# Altium schematic sheet ArbPwrBoost_P4.SchDoc: =ProjectTitle
size B; Engineer: Hab Collector; Organization: Altium Limited; Address1: 3621 Gin Way; Address2: Snellville, GA 30039; SheetNumber: 4; SheetTotal: 8
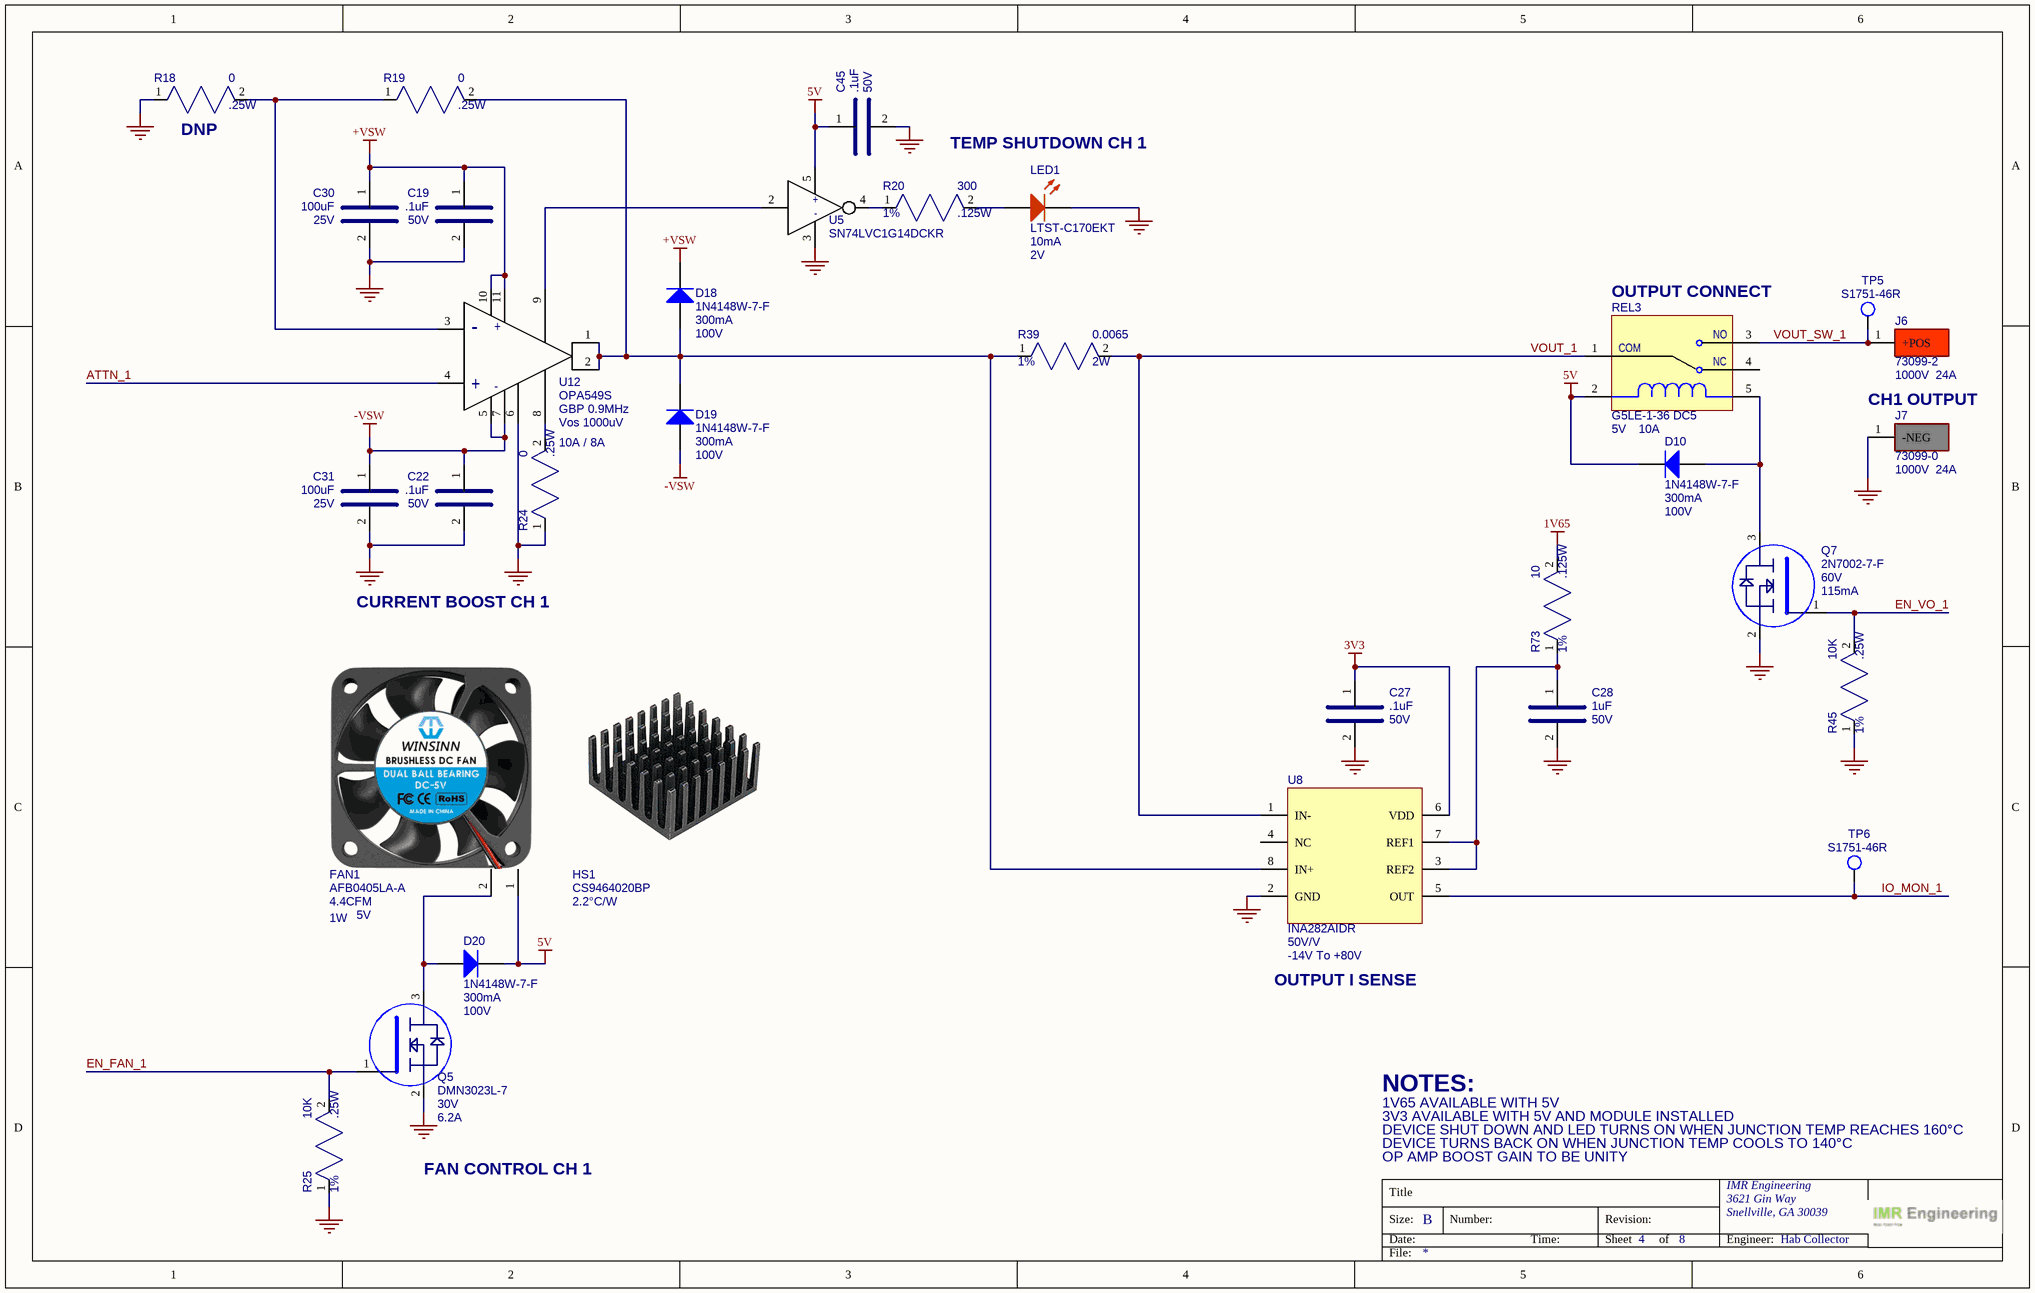
[diagram p0: ArbPwrBoost_P4.SchDoc]

## Parts
C19  value .1uF  Voltage: 50V  [CAP_0805]  (hidden comment: KGM21NR71H104KT)
C22  value .1uF  Voltage: 50V  [CAP_0805]  (hidden comment: KGM21NR71H104KT)
C27  value .1uF  Voltage: 50V  [CAP_0805]  (hidden comment: KGM21NR71H104KT)
C28  value 1uF  Voltage: 50V  [CAP_0805]  (hidden comment: 08055C105K4T2A)
C30  value 100uF  Voltage: 25V  [CAPC6153X670N]  (hidden comment: KCM55WC71E107MH13L)
C31  value 100uF  Voltage: 25V  [CAPC6153X670N]  (hidden comment: KCM55WC71E107MH13L)
C45  value .1uF  Voltage: 50V  [CAP_0805]  (hidden comment: KGM21NR71H104KT)
D10  value 100V  Current: 300mA  [SOD123]  (hidden comment: 1N4148W-7-F)
D18  value 100V  Current: 300mA  [SOD123]  (hidden comment: 1N4148W-7-F)
D19  value 100V  Current: 300mA  [SOD123]  (hidden comment: 1N4148W-7-F)
D20  value 100V  Current: 300mA  [SOD123]  (hidden comment: 1N4148W-7-F)
FAN1  Air Flow: 4.4CFM  Voltage: 5V  Power: 1W  [FAN_AFB0405LA-A]  (hidden comment: AFB0405LA-A)
HS1  Thermal Resistance: 2.2°C/W  [HEATSINK_CS9464020BP]  (hidden comment: CS9464020BP)
J6  value 1000V  Current: 24A  [Pomona_73099-2]  (hidden comment: 73099-2)
J7  value 1000V  Current: 24A  [Pomona_73099-0]  (hidden comment: 73099-0)
LED1  value 2V  Current: 10mA  [LED_0805]  (hidden comment: LTST-C170EKT)
Q5  value 30V  Current: 6.2A  [SOT-23]  (hidden comment: DMN3023L-7)
Q7  value 60V  Current: 115mA  [SOT-23]  (hidden comment: 2N7002-7-F)
R18  value 0  Power: .25W  [RES_0805]  (hidden comment: RC0805JR-070RL)
R19  value 0  Power: .25W  [RES_0805]  (hidden comment: RC0805JR-070RL)
R20  value 300  Power: .125W  Tolerance: 1%  [RES_0805]  (hidden comment: RC0805FR-07300RL)
R24  value 0  Power: .25W  [RES_0805]  (hidden comment: RC0805JR-070RL)
R25  value 10K  Power: .25W  Tolerance: 1%  [RES_0805]  (hidden comment: RC0805FR-7W10KL)
R39  value 0.0065  Tolerance: 1%  Power: 2W  [RES_2512]  (hidden comment: WSL25126L500FEA18)
R45  value 10K  Power: .25W  Tolerance: 1%  [RES_0805]  (hidden comment: RC0805FR-7W10KL)
R73  value 10  Power: .125W  Tolerance: 1%  [RES_0805]  (hidden comment: RC0805FR-1310RL)
REL3  value 5V  Current: 10A  [G5LE]  (hidden comment: G5LE-1-36 DC5)
TP5  S1751-46R  [HARWIN_S1751]
TP6  S1751-46R  [HARWIN_S1751]
U5  SN74LVC1G14DCKR  [SOT-353]
U8  value 50V/V  Common Mode: -14V To +80V  [SOIC-8_54]  (hidden comment: INA282AIDR)
U12  value GBP 0.9MHz  Vos: Vos 1000uV  Peak / Contineous Current: 10A / 8A  [POWER_PACKAGE_11]  (hidden comment: OPA549S)

## Nets
1V65: R73.2
3V3: C27.1 U8.6(VDD)
5V: C45.1 D10.2(K) D20.2(K) FAN1.1 REL3.2 U5.5
+VSW: C19.1 C30.1 D18.2(K) U12.10 U12.11
-VSW: C22.1 C31.1 D19.1(A) U12.5 U12.7
GND: C19.2 C22.2 C27.2 C28.2 C30.2 C31.2 C45.2 J7.1(-NEG) LED1.K Q5.2(E) Q7.2(E) R18.1 R24.1 R25.1 R45.1 U5.3 U8.2(GND) U12.6
ATTN_1: U12.4(+)
EN_FAN_1: Q5.1(B) R25.2
EN_VO_1: Q7.1(B) R45.2
IO_MON_1: TP6.1 U8.5(OUT)
VOUT_1: R39.2 REL3.1(COM) U8.1(IN-)
VOUT_SW_1: J6.1(+POS) REL3.3(NO) TP5.1
NetC28_1: C28.1 R73.1 U8.3(REF2) U8.7(REF1)
NetD10_1: D10.1(A) Q7.3(C) REL3.5
NetD18_1: D18.1(A) D19.2(K) R19.2 R39.1 U8.8(IN+) U12.1 U12.2
NetD20_1: D20.1(A) FAN1.2 Q5.3(C)
NetLED1_A: LED1.A R20.2
NetR18_2: R18.2 R19.1 U12.3(-)
NetR20_1: R20.1 U5.4(Y)
NetR24_2: R24.2 U12.8
NetU5_2: U5.2(A) U12.9

Not connected (* = marked no-connect by the designer): REL3 4(NC); U8 4(NC)

## Notes on the sheet
- (near R18) DNP
- TEMP SHUTDOWN CH 1
- (near REL3) OUTPUT CONNECT
- (near J7) CH1 OUTPUT
- CURRENT BOOST CH 1
- OUTPUT I SENSE
- NOTES:
- 1V65 AVAILABLE WITH 5V
- FAN CONTROL CH 1
- 3V3 AVAILABLE WITH 5V AND MODULE INSTALLED
- DEVICE SHUT DOWN AND LED TURNS ON WHEN JUNCTION TEMP REACHES 160°C
- DEVICE TURNS BACK ON WHEN JUNCTION TEMP COOLS TO 140°C
- OP AMP BOOST GAIN TO BE UNITY
- Title
- Size:
- Date:
- B
- Number:
- Time:
- Revision:
- Sheet
- of
- IMR Engineering
- Engineer:
- File:
- (in symbol IC_SN74LVC1G14DCKR) +; -

## Library data of the parts
C19 C22 C27 C45 = CAP_SMD_0.1UF_50V_0805: CAP CER 0.1UF 50V X7R 0805; MFG: KYOCERA AVX; Case/Package: 0805; MFG_PN: KGM21NR71H104KT; Supplier 1: DigiKey; Supplier Part Number 1: 478-KGM21NR71H104KTCT-ND; Unit Price: .1
C28 = CAP_SMD_1UF_50V_0805: CAP CER 1UF 50V X7R 0805; MFG: KYOCERA AVX; Case/Package: 0805; MFG_PN: 08055C105K4T2A; Supplier 1: DigiKey; Supplier Part Number 1: 478-KAM21KR71H105KUCT-ND; Unit Price: .27
C30 C31 = CAP_SMD_100UF_25V_SMD: CAP CER 100UF 25V X7S SMD; MFG: Murata Electronics; Case/Package: CAPC6153X670N; MFG_PN: KCM55WC71E107MH13L; Supplier 1: DigiKey; Supplier Part Number 1: 490-KCM55WC71E107MH13LCT-ND; Unit Price: 5.68
D10 D18-D20 = DIODE_1N4148W-7-F: RELAY REED SPDT 250MA 5V; MFG: Diodes Inc; Case/Package: SOD-123; Supplier 1: DigiKey; Supplier Part Number 1: 1N4148W-FDICT-ND; Unit Price: .16; MFG_PN: 1N4148W-7-F
FAN1 = FAN_AFB0405LA-A: FAN AXIAL 40X10MM BALL 5VDC WIRE; MFG: Delta Electronicis; Case/Package: 40x40x10mm; Supplier 1: DigiKey; Supplier Part Number 1: 603-2014-ND; Unit Price: 7.31; MFG_PN: AFB0405LA-A
HS1 = HEATSINK_CS9464020BP: Heat Sink Aluminum Top Mount; MFG: Cooling Source; Case/Package: 40x40x20mm; Supplier 1: DigiKey; Supplier Part Number 1: 4165-CS9464020BP-ND; Unit Price: 3.41; MFG_PN: CS9464020BP
J6 = CONN_PANOMA_73099-2: CONN 4mm Banana Socket Right Angle PCB RED; MFG: Pomona; Case/Package: 73099-2; Supplier 1: DigiKey; Supplier Part Number 1: 501-73099-2-ND; Unit Price: 10.39; MFG_PN: 73099-2
J7 = CONN_PANOMA_73099-0: CONN 4mm Banana Socket Right Angle PCB BLK; MFG: Pomona; Case/Package: 73099-0; Supplier 1: DigiKey; Supplier Part Number 1: 501-73099-0-ND; Unit Price: 10.39; MFG_PN: 73099-0
LED1 = LED_RED_LTST-C170EKT: LED RED CLEAR SMD; MFG: Diodes Inc; Case/Package: 0805; Supplier 1: DigiKey; Supplier Part Number 1: 160-1178-1-ND; Unit Price: .18; MFG_PN: LTST-C170EKT
Q5 = MOSFET_NCH_DMN3023L-7: MOSFET N-CH 30V 6.2A SOT23-3; MFG: Diodes Inc; Case/Package: SOT-23; Supplier 1: DigiKey; Supplier Part Number 1: DMN3023L-7DICT-ND; Unit Price: .48; MFG_PN: DMN3023L-7
Q7 = MOSFET_NCH_2N7002-7-F: MOSFET N-CH 60V 115MA SOT23-3; MFG: Diodes Inc; Case/Package: SOT-23; Supplier 1: DigiKey; Supplier Part Number 1: 2N7002-FDICT-ND; Unit Price: .20; MFG_PN: 2N7002-7-F
R18 R19 R24 = RES_SMD_0_0805_1/8W_1%: RES SMD 0 OHM 1% 1/8W 0805; MFG: Yageo; Case/Package: 0805; MFG_PN: RC0805JR-070RL; Supplier 1: DigiKey; Supplier Part Number 1: 311-0.0ARCT-ND; Unit Price: .1; Tolerance: 1%
R20 = RES_SMD_300_0805_1/8W_1%: RES SMD 300 OHM 1% 1/8W 0805; MFG: Yageo; Case/Package: 0805; MFG_PN: RC0805FR-07300RL; Supplier 1: DigiKey; Supplier Part Number 1: 311-300CRCT-ND; Unit Price: .1
R25 R45 = RES_SMD_10K_0805_1/4W_1%: RES SMD 10K OHM 1% 1/4W 0805; MFG: Yageo; Case/Package: 0805; MFG_PN: RC0805FR-7W10KL; Supplier 1: DigiKey; Supplier Part Number 1: 13-RC0805FR-7W10KLCT-ND; Unit Price: .10
R39 = RES_SMD_0.0065_2512_2W_1%: RES SMD 0.0065 OHM 1% 2W 2512; MFG: Vishay Dale; Case/Package: 2512; MFG_PN: WSL25126L500FEA18; Supplier 1: DigiKey; Supplier Part Number 1: 541-WSL25126L500FEA18CT-ND; Unit Price: 1.76
R73 = RES_SMD_10_0805_1/8W_1%: RES SMD 10 OHM 1% 1/8W 0805; MFG: Yageo; Case/Package: 0805; MFG_PN: RC0805FR-1310RL; Supplier 1: DigiKey; Supplier Part Number 1: 13-RC0805FR-1310RLCT-ND; Unit Price: .1
REL3 = RELAY_G5LE-1-36 DC5: RELAY GEN PURPOSE SPDT 10A 5V; MFG: Omron; Case/Package: G5LE; Supplier 1: DigiKey; Supplier Part Number 1: G5LE-1-36DC5-ND; Unit Price: 1.24; Supplier: DigiKey; Manufacturer: Omron; MFG_PN: G5LE-1-36 DC5
TP5 TP6 = CONN_TEST_POINT_S1751-46R: PCB TEST POINT CONNECT; MFG: Harwin Inc; Case/Package: S1751; MFG_PN: S1751-46R; Supplier 1: Digi-Key; Supplier Part Number 1: 952-1478-1-ND; Value: *; Unit Price: .28
U5 = IC_SN74LVC1G14DCKR: IC INVERT SCHMITT 1CH 1IN SC70-5; MFG: Texas Instruments; Unit Price: .10; Package/Case: SC70-5; Supplier 1: DigiKey; Supplier Part Number 1: 296-11608-1-ND; MFG_PN: SN74LVC1G14DCKR
U8 = IC_INA282AIDR: IC CURRENT SENSE 0.4% 50V/V SOIC-8; MFG: Texas Instruments; Case/Package: SOIC-8; Supplier 1: DigiKey; Supplier Part Number 1: 296-27820-1-ND; Unit Price: 4.13; MFG_PN: INA282AIDR
U12 = OPAMP_OPA549S: IC OPAMP POWER 1 CIRC 11PWRPACK; MFG: Texas Instruments; Unit Price: 26.94; Package/Case: Power Package-11; Supplier 1: DigiKey; Supplier Part Number 1: OPA549S-ND; MFG_PN: OPA549S